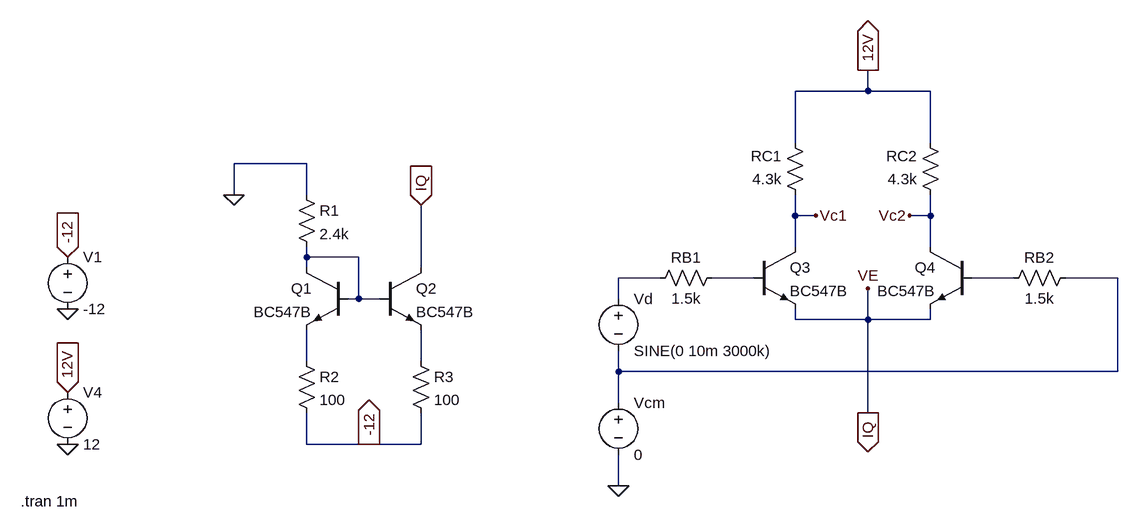
[diagram p0: schematic Draft1.asc]
Draft1.asc, the LTspice schematic file:
Version 4
SHEET 1 1368 696
WIRE 976 48 976 16
WIRE 976 48 864 48
WIRE 1072 48 976 48
WIRE 864 128 864 48
WIRE 1072 128 1072 48
WIRE 112 160 0 160
WIRE 0 208 0 160
WIRE 112 208 112 160
WIRE 864 240 864 208
WIRE 896 240 864 240
WIRE 1072 240 1072 208
WIRE 1072 240 1040 240
WIRE 864 288 864 240
WIRE 1072 288 1072 240
WIRE 112 304 112 288
WIRE 192 304 112 304
WIRE 112 320 112 304
WIRE 288 320 288 224
WIRE 656 336 592 336
WIRE 800 336 736 336
WIRE 1200 336 1136 336
WIRE 1360 336 1280 336
WIRE 192 368 192 304
WIRE 192 368 176 368
WIRE 224 368 192 368
WIRE 592 368 592 336
WIRE 864 400 864 384
WIRE 976 400 976 352
WIRE 976 400 864 400
WIRE 1072 400 1072 384
WIRE 1072 400 976 400
WIRE 112 464 112 416
WIRE 288 464 288 416
WIRE 592 480 592 448
WIRE 1360 480 1360 336
WIRE 1360 480 592 480
WIRE 592 528 592 480
WIRE 976 544 976 400
WIRE 112 592 112 544
WIRE 208 592 112 592
WIRE 288 592 288 544
WIRE 288 592 208 592
WIRE 592 656 592 608
FLAG 0 208 0
FLAG -256 384 0
FLAG -256 304 -12
IOPIN -256 304 In
FLAG 208 592 -12
IOPIN 208 592 Out
FLAG 592 656 0
FLAG -256 592 0
FLAG -256 512 12V
IOPIN -256 512 In
FLAG 976 16 12V
IOPIN 976 16 Out
FLAG 288 224 IQ
IOPIN 288 224 In
FLAG 976 544 IQ
IOPIN 976 544 Out
FLAG 896 240 Vc1
FLAG 1040 240 Vc2
FLAG 976 352 VE
SYMBOL res 96 192 R0
SYMATTR InstName R1
SYMATTR Value 2.4k
SYMBOL npn 176 320 M0
SYMATTR InstName Q1
SYMATTR Value BC547B
SYMBOL npn 224 320 R0
SYMATTR InstName Q2
SYMATTR Value BC547B
SYMBOL res 96 448 R0
SYMATTR InstName R2
SYMATTR Value 100
SYMBOL res 272 448 R0
SYMATTR InstName R3
SYMATTR Value 100
SYMBOL voltage -256 288 R0
SYMATTR InstName V1
SYMATTR Value -12
SYMBOL npn 800 288 R0
SYMATTR InstName Q3
SYMATTR Value BC547B
SYMBOL npn 1136 288 M0
SYMATTR InstName Q4
SYMATTR Value BC547B
SYMBOL res 752 320 R90
WINDOW 0 0 56 VBottom 2
WINDOW 3 32 56 VTop 2
SYMATTR InstName RB1
SYMATTR Value 1.5k
SYMBOL res 1296 320 R90
WINDOW 0 0 56 VBottom 2
WINDOW 3 32 56 VTop 2
SYMATTR InstName RB2
SYMATTR Value 1.5k
SYMBOL res 880 224 R180
WINDOW 0 36 76 Left 2
WINDOW 3 36 40 Left 2
SYMATTR InstName RC1
SYMATTR Value 4.3k
SYMBOL res 1088 224 R180
WINDOW 0 36 76 Left 2
WINDOW 3 36 40 Left 2
SYMATTR InstName RC2
SYMATTR Value 4.3k
SYMBOL voltage 592 352 R0
WINDOW 123 0 0 Left 0
WINDOW 39 0 0 Left 0
SYMATTR InstName Vd
SYMATTR Value SINE(0 10m 3000k)
SYMBOL voltage 592 512 R0
SYMATTR InstName Vcm
SYMATTR Value 0
SYMBOL voltage -256 496 R0
SYMATTR InstName V4
SYMATTR Value 12
TEXT -328 680 Left 2 !.tran 1m

The netlist it stands for:
* Draft1.asc
R1 0 N001 2.4k
Q1 N001 N001 N006 0 BC547B
Q2 VE N001 N007 0 BC547B
R2 N006 -12 100
R3 N007 -12 100
V1 -12 0 -12
Q3 Vc1 N003 VE 0 BC547B
Q4 Vc2 N004 VE 0 BC547B
RB1 N003 N002 1.5k
RB2 N005 N004 1.5k
RC1 Vc1 12V 4.3k
RC2 Vc2 12V 4.3k
Vd N002 N005 SINE(0 10m 3000k)
Vcm N005 0 0
V4 12V 0 12
.model NPN NPN
.model PNP PNP
.lib standard.bjt
.tran 1m
.backanno
.end